# EAGLE schematic REV1 (EAGLE 7.1.0)
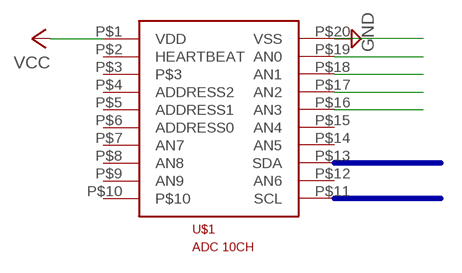
[diagram p0: schematic, sheet 1]

## Parts
U$1  ADC-10CHDIP20  [ADC-10CH]

## Nets
GND: U$1.P$20(VSS)
N$1: U$1.P$19(AN0)
N$2: U$1.P$18(AN1)
N$3: U$1.P$17(AN2)
N$4: U$1.P$16(AN3)
VCC: U$1.P$1(VDD)
Unconnected: U$1.P$2(HEARTBEAT) U$1.P$3 U$1.P$4(ADDRESS2) U$1.P$5(ADDRESS1) U$1.P$6(ADDRESS0) U$1.P$7(AN7) U$1.P$8(AN8) U$1.P$9(AN9) U$1.P$10 U$1.P$11(SCL) U$1.P$12(AN6) U$1.P$13(SDA) U$1.P$14(AN5) U$1.P$15(AN4)

## Buses
B$1
B$2

## Library data of the parts
U$1 = Hobbytronics:ADC-10CH